# EAGLE design baseboard_v3 (EAGLE 8.1.0)
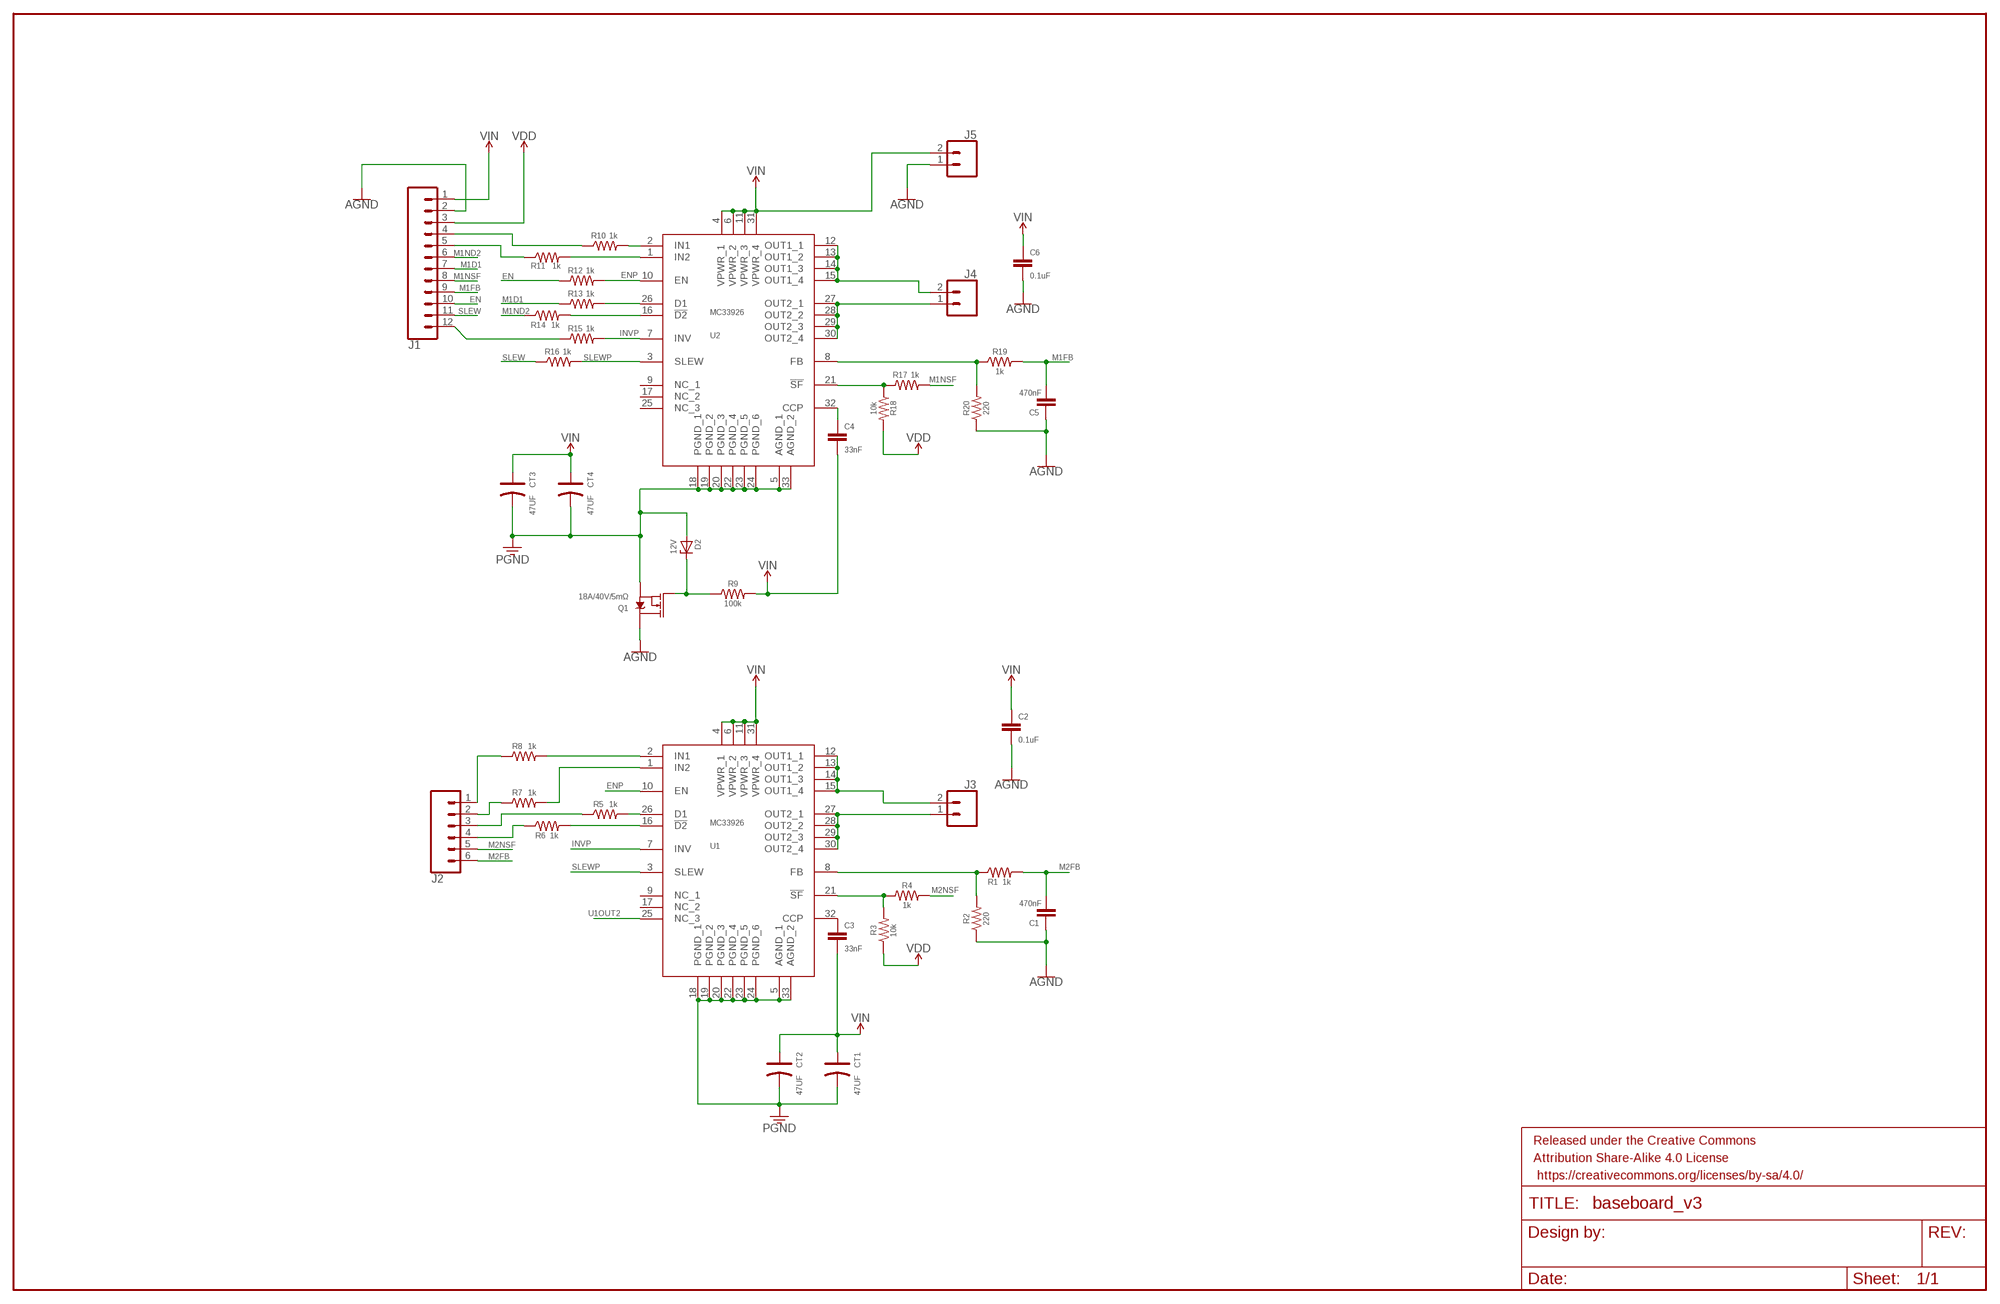
[diagram p0: schematic, sheet 1]

## Parts
C1  470nF  470NF-0402-16V-10%  [0402]
C2  0.1uF  0.1UF-0603-25V-(+80/-20%)  [0603]
C3  33nF  33NF-0603-50V-10%  [0603]
C4  33nF  33NF-0603-50V-10%  [0603]
C5  470nF  470NF-0402-16V-10%  [0402]
C6  0.1uF  0.1UF-0603-25V-(+80/-20%)  [0603]
CT1  47UF  ALUMINUM-SMD-47UF-25V(D6.3-H5.3MM)  [ELECTRO-SMD-C-6MM]
CT2  47UF  ALUMINUM-SMD-47UF-25V(D6.3-H5.3MM)  [ELECTRO-SMD-C-6MM]
CT3  47UF  ALUMINUM-SMD-47UF-25V(D6.3-H5.3MM)  [ELECTRO-SMD-C-6MM]
CT4  47UF  ALUMINUM-SMD-47UF-25V(D6.3-H5.3MM)  [ELECTRO-SMD-C-6MM]
D2  12V  ZENER-DIODESOD80C  [SOD80C]
FRAME1  FRAME-LEDGER  [CREATIVE_COMMONS]
J1  CONN_12NO_SILK  [1X12_NO_SILK]
J2  CONN_06NO_SILK_FEMALE_PTH  [1X06_NO_SILK]
J3  CONN_023.5MM-NO_SILK  [SCREWTERMINAL-3.5MM-2-NS]
J4  CONN_023.5MM-NO_SILK  [SCREWTERMINAL-3.5MM-2-NS]
J5  CONN_023.5MM-NO_SILK  [SCREWTERMINAL-3.5MM-2-NS]
Q1  18A/40V/5mΩ  MOSFET-NCH-FDS6630A  [SO08]
R1  1k  1KOHM-0603-1/10W-1%  [0603]
R2  220  220OHM-0603-1/10W-1%  [0603]
R3  10k  10KOHM-0603-1/10W-1%  [0603]
R4  1k  1KOHM-0603-1/10W-1%  [0603]
R5  1k  1KOHM-0603-1/10W-1%  [0603]
R6  1k  1KOHM-0603-1/10W-1%  [0603]
R7  1k  1KOHM-0603-1/10W-1%  [0603]
R8  1k  1KOHM-0603-1/10W-1%  [0603]
R9  100k  100KOHM-0603-1/10W-1%  [0603]
R10  1k  1KOHM-0603-1/10W-1%  [0603]
R11  1k  1KOHM-0603-1/10W-1%  [0603]
R12  1k  1KOHM-0603-1/10W-1%  [0603]
R13  1k  1KOHM-0603-1/10W-1%  [0603]
R14  1k  1KOHM-0603-1/10W-1%  [0603]
R15  1k  1KOHM-0603-1/10W-1%  [0603]
R16  1k  1KOHM-0603-1/10W-1%  [0603]
R17  1k  1KOHM-0603-1/10W-1%  [0603]
R18  10k  10KOHM-0603-1/10W-1%  [0603]
R19  1k  1KOHM-0603-1/10W-1%  [0603]
R20  220  220OHM-0603-1/10W-1%  [0603]
U1  MC33926  [PQFN32_0P8_8X8_SLUG]
U2  MC33926  [PQFN32_0P8_8X8_SLUG]

## Nets
AGND: C1.1 C2.2 C5.1 C6.2 J1.2 J5.1 Q1.5(D) Q1.6(D) Q1.7(D) Q1.8(D) R2.1 R20.1
EN: J1.10 R12.1
ENP: R12.2 U1.10(EN) U2.10(EN)
INV: J1.12 R15.1
INVP: R15.2 U1.7(INV) U2.7(INV)
M1D1: J1.7 R13.1
M1FB: C5.2 J1.9 R19.2
M1IN1: J1.4 R10.1
M1IN2: J1.5 R11.1
M1ND2: J1.6 R14.1
M1NSF: J1.8 R17.2
M2D1: J2.3 R5.1
M2FB: C1.2 J2.6 R1.2
M2IN1: J2.1(>NAME) R8.1
M2IN2: J2.2 R7.1
M2ND2: J2.4 R6.1
M2NSF: J2.5 R4.2
PGND: CT1.- CT2.- CT3.- CT4.- D2.A Q1.1(S) Q1.2(S) Q1.3(S) U1.5(AGND_1) U1.18(PGND_1) U1.19(PGND_2) U1.20(PGND_3) U1.22(PGND_4) U1.23(PGND_5) U1.24(PGND_6) U1.33(AGND_2) U2.5(AGND_1) U2.18(PGND_1) U2.19(PGND_2) U2.20(PGND_3) U2.22(PGND_4) U2.23(PGND_5) U2.24(PGND_6) U2.33(AGND_2)
SLEW: J1.11 R16.1
SLEWP: R16.2 U1.3(SLEW) U2.3(SLEW)
U1CCP: C3.1 U1.32(CCP)
U1D1: R5.2 U1.26(D1)
U1FB: R1.1 R2.2 U1.8(FB)
U1IN1: R8.2 U1.2(IN1)
U1IN2: R7.2 U1.1(IN2)
U1ND2: R6.2 U1.16(!D2)
U1NSF: R3.2 R4.1 U1.21(!SF)
U1OUT1: J3.2 U1.12(OUT1_1) U1.13(OUT1_2) U1.14(OUT1_3) U1.15(OUT1_4)
U1OUT2: J3.1 U1.25(NC_3) U1.27(OUT2_1) U1.28(OUT2_2) U1.29(OUT2_3) U1.30(OUT2_4)
U2CCP: C4.1 U2.32(CCP)
U2D1: R13.2 U2.26(D1)
U2FB: R19.1 R20.2 U2.8(FB)
U2IN1: R10.2 U2.2(IN1)
U2IN2: R11.2 U2.1(IN2)
U2ND2: R14.2 U2.16(!D2)
U2NSF: R17.1 R18.1 U2.21(!SF)
U2OUT1: J4.2 U2.12(OUT1_1) U2.13(OUT1_2) U2.14(OUT1_3) U2.15(OUT1_4)
U2OUT2: J4.1 U2.27(OUT2_1) U2.28(OUT2_2) U2.29(OUT2_3) U2.30(OUT2_4)
VCC: J1.3 R3.1 R18.2 ; supply symbol labelled VDD
VGATE: D2.C Q1.4(G) R9.1
VIN: C2.1 C3.2 C4.2 C6.1 CT1.+ CT2.+ CT3.+ CT4.+ J1.1 J5.2 R9.2 U1.4(VPWR_1) U1.6(VPWR_2) U1.11(VPWR_3) U1.31(VPWR_4) U2.4(VPWR_1) U2.6(VPWR_2) U2.11(VPWR_3) U2.31(VPWR_4)
Unconnected: U1.9(NC_1) U1.17(NC_2) U2.9(NC_1) U2.17(NC_2) U2.25(NC_3)

## Library data of the parts
C1 C5 = SparkFun-Capacitors:470NF: 0.47uF/470nF ceramic capacitors A capacitor is a passive two-terminal electrical component used to store electrical energy temporarily in an electric field.; PROD_ID: CAP-09041
C2 C6 = SparkFun-Capacitors:0.1UF: 0.1µF ceramic capacitors A capacitor is a passive two-terminal electrical component used to store electrical energy temporarily in an electric field.; PROD_ID: CAP-00810
C3 C4 = SparkFun-Capacitors:33NF: 33nF ceramic capacitors A capacitor is a passive two-terminal electrical component used to store electrical energy temporarily in an electric field.; PROD_ID: CAP-07887
CT1-CT4 = Seeed-OPL-Capacitor:ALUMINUM-SMD-47UF-25V(D6.3-H5.3MM): 302030059; MPN: CS1E470M-CRE54
D2 = diode:ZENER-DIODE: Z-Diode
FRAME1 = SparkFun-Aesthetics:FRAME-LEDGER: Schematic Frame - Ledger Standard 11x14 US Ledger frame
J1 = SparkFun-Connectors:CONN_12: Multi connection point. Often used as Generic Header-pin footprint for 0.1 inch spaced/style header connections On any of the 0.1 inch spaced packages, you can populate with these: Break Away Headers - Straight <https://www.sparkfun.com/products/116> (PRT-00116) Break Away Male Headers - Right Angle <https://www.sparkfun.com/products/553> (PRT-00553) Female Headers <https://www.sparkfun.com/products/115> (PRT-00115) Break Away Headers - Machine Pin <https://www.sparkfun.com/products/117> (PRT-00117) Break Away Female Headers - Swiss Machine Pin <https://www.sparkfun.com/products/743> (PRT-00743) For SCREWTERMINALS and SPRING TERMINALS visit here: Screw Terimnals on SparkFun.com <https://www.sparkfun.com/search/results?term=Screw+Terminals> (5mm/3.5mm/2.54mm spacing) This device is also useful as a general connection point to wire up your design to another part of your project. Our various solder wires solder well into these plated through hole pads. Hook-Up Wire - Assortment (Stranded, 22 AWG) <https://www.sparkfun.com/products/11375> (PRT-11375) Hook-Up Wire - Assortment (Solid Core, 22 AWG) <https://www.sparkfun.com/products/11367> (PRT-11367) View the entire wire category on our website here <https://www.sparkfun.com/categories/141> Special notes: Molex polarized connector foot print use with SKU : PRT-08231 with associated crimp pins and housings. 1MM SMD Version SKU: PRT-10208 NOTES ON THE VARIANTS LOCK and LOCK_LONGPADS... This footprint was designed to help hold the alignment of a through-hole component (i.e. 6-pin header) while soldering it into place. You may notice that each hole has been shifted either up or down by 0.005 of an inch from it's more standard position (which is a perfectly straight line). This slight alteration caused the pins (the squares in the middle) to touch the edges of the holes. Because they are alternating, it causes a "brace" to hold the component in place. 0.005 has proven to be the perfect amount of "off-center" position when using our standard breakaway headers. Although looks a little odd when you look at the bare footprint, once you have a header in there, the alteration is very hard to notice. Also,if you push a header all the way into place, it is covered up entirely on the bottom side.
J2 = SparkFun-Connectors:CONN_06: Multi connection point. Often used as Generic Header-pin footprint for 0.1 inch spaced/style header connections On any of the 0.1 inch spaced packages, you can populate with these: Break Away Headers - Straight <https://www.sparkfun.com/products/116> (PRT-00116) Break Away Male Headers - Right Angle <https://www.sparkfun.com/products/553> (PRT-00553) Female Headers <https://www.sparkfun.com/products/115> (PRT-00115) Break Away Headers - Machine Pin <https://www.sparkfun.com/products/117> (PRT-00117) Break Away Female Headers - Swiss Machine Pin <https://www.sparkfun.com/products/743> (PRT-00743) Arduino Stackable Header - 6 Pin <https://www.sparkfun.com/products/9280> (PRT-09280) For SCREWTERMINALS and SPRING TERMINALS visit here: Screw Terimnals on SparkFun.com <https://www.sparkfun.com/search/results?term=Screw+Terminals> (5mm/3.5mm/2.54mm spacing) This device is also useful as a general connection point to wire up your design to another part of your project. Our various solder wires solder well into these plated through hole pads. Hook-Up Wire - Assortment (Stranded, 22 AWG) <https://www.sparkfun.com/products/11375> (PRT-11375) Hook-Up Wire - Assortment (Solid Core, 22 AWG) <https://www.sparkfun.com/products/11367> (PRT-11367) View the entire wire category on our website here <https://www.sparkfun.com/categories/141>; PROD_ID: CONN-08437
J3-J5 = SparkFun-Connectors:CONN_02: Multi connection point. Often used as Generic Header-pin footprint for 0.1 inch spaced/style header connections On any of the 0.1 inch spaced packages, you can populate with these: Break Away Headers - Straight <https://www.sparkfun.com/products/116> (PRT-00116) Break Away Male Headers - Right Angle <https://www.sparkfun.com/products/553> (PRT-00553) Female Headers <https://www.sparkfun.com/products/115> (PRT-00115) Break Away Headers - Machine Pin <https://www.sparkfun.com/products/117> (PRT-00117) Break Away Female Headers - Swiss Machine Pin <https://www.sparkfun.com/products/743> (PRT-00743) For SCREWTERMINALS and SPRING TERMINALS visit here: Screw Terimnals on SparkFun.com <https://www.sparkfun.com/search/results?term=Screw+Terminals> (5mm/3.5mm/2.54mm spacing) This device is also useful as a general connection point to wire up your design to another part of your project. Our various solder wires solder well into these plated through hole pads. Hook-Up Wire - Assortment (Stranded, 22 AWG) <https://www.sparkfun.com/products/11375> (PRT-11375) Hook-Up Wire - Assortment (Solid Core, 22 AWG) <https://www.sparkfun.com/products/11367> (PRT-11367) View the entire wire category on our website here <https://www.sparkfun.com/categories/141> Special notes: Molex polarized connector foot print use with: PRT-08233 with associated crimp pins and housings. 2.54_SCREWTERM for use with PRT-10571. 3.5mm Screw Terminal footprints for PRT-08084 5mm Screw Terminal footprints for use with PRT-08432; PROD_ID: CONN-08399
Q1 = SparkFun-DiscreteSemi:MOSFET-NCH: N-channel MOSFETs Voltage controlled devices that allow control of high current outputs. SparkFun Products: SparkFun OpenScale <https://www.sparkfun.com/products/13261> SparkFun Digital Sandbox <https://www.sparkfun.com/products/12651> SparkFun Monster Moto Shield <https://www.sparkfun.com/products/10182> SparkFun MOSFET Power Controller <https://www.sparkfun.com/products/11214>; PROD_ID: TRANS-08089; VALUE: 6.5A/30V/38mΩ
R1 R4-R8 R10-R17 R19 = SparkFun-Resistors:1KOHM: 1kΩ resistor A resistor is a passive two-terminal electrical component that implements electrical resistance as a circuit element. Resistors act to reduce current flow, and, at the same time, act to lower voltage levels within circuits. - Wikipedia; PROD_ID: RES-07856
R2 R20 = SparkFun-Resistors:220OHM: 220Ω resistor A resistor is a passive two-terminal electrical component that implements electrical resistance as a circuit element. Resistors act to reduce current flow, and, at the same time, act to lower voltage levels within circuits. - Wikipedia; PROD_ID: RES-07861
R3 R18 = SparkFun-Resistors:10KOHM: 10kΩ resistor A resistor is a passive two-terminal electrical component that implements electrical resistance as a circuit element. Resistors act to reduce current flow, and, at the same time, act to lower voltage levels within circuits. - Wikipedia; PROD_ID: RES-00824
R9 = SparkFun-Resistors:100KOHM: 100kΩ resistor A resistor is a passive two-terminal electrical component that implements electrical resistance as a circuit element. Resistors act to reduce current flow, and, at the same time, act to lower voltage levels within circuits. - Wikipedia; PROD_ID: RES-07828
U1 U2 = Freescale_Element_Modified:MC33926

## Board
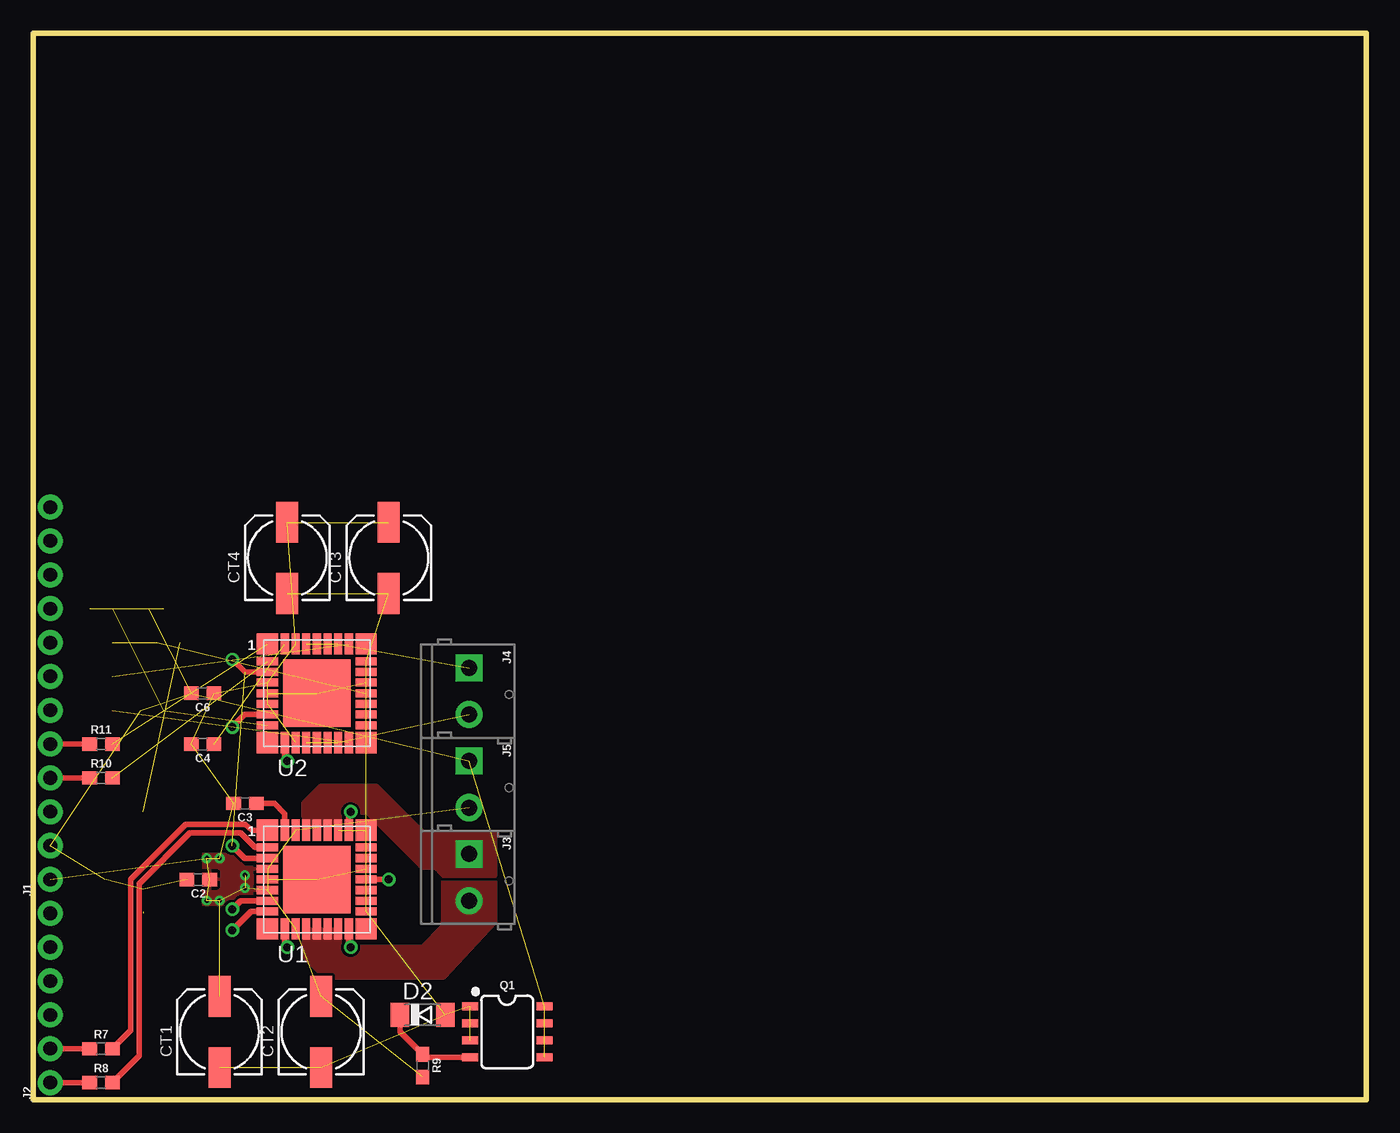
[diagram p1: board, top side]
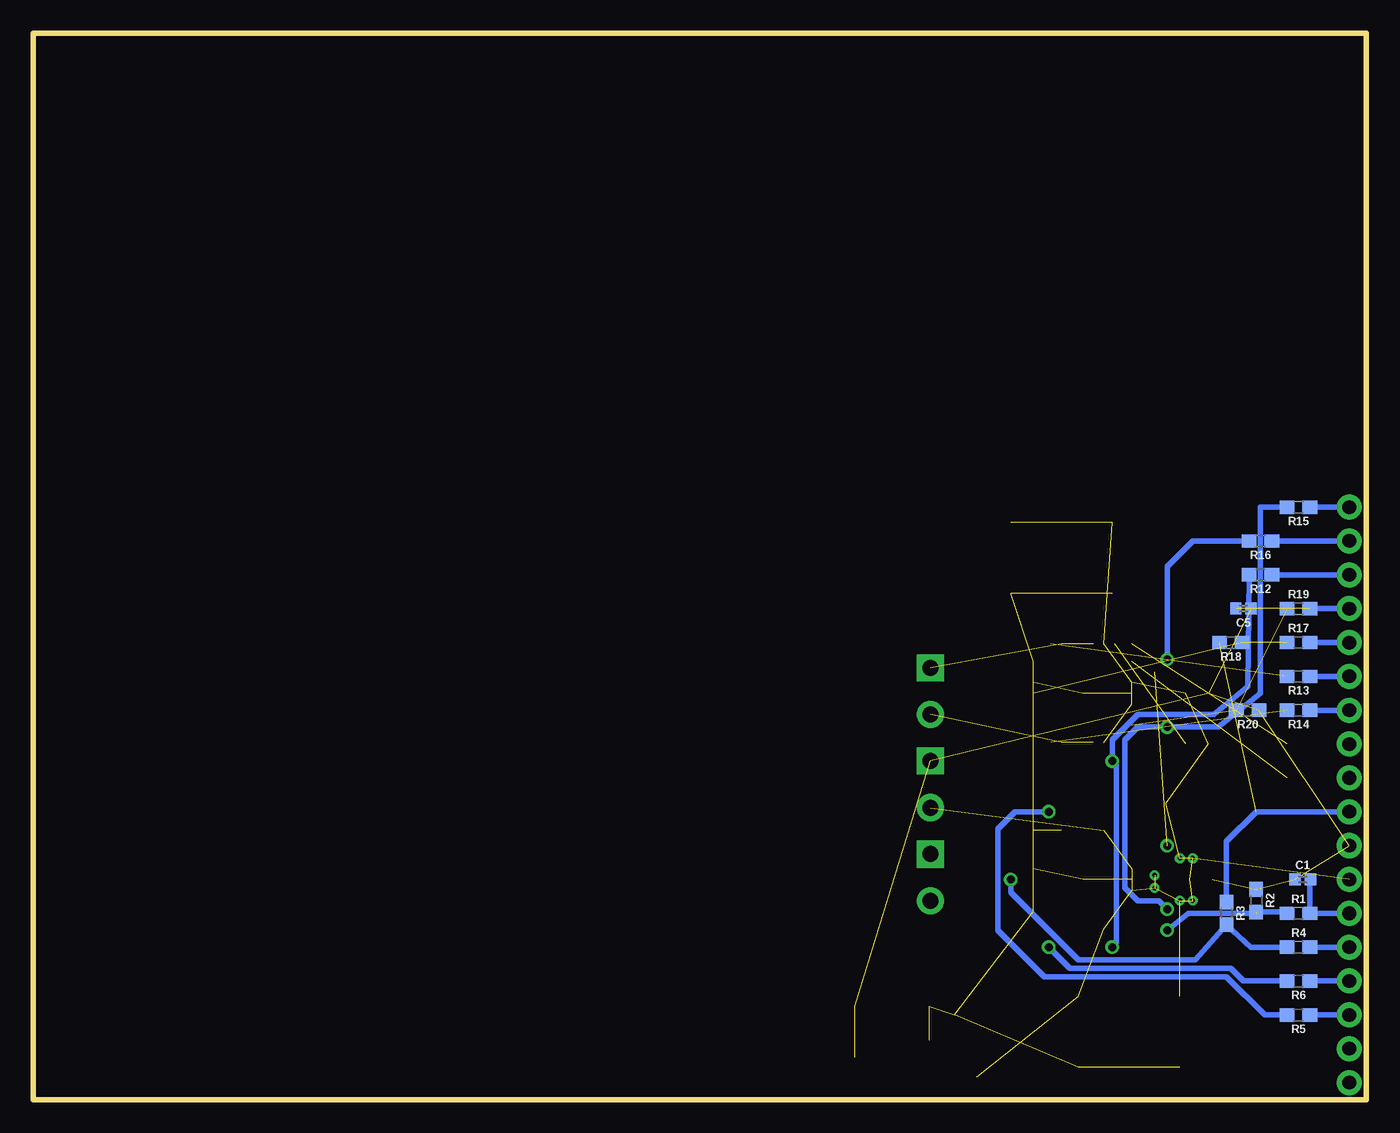
[diagram p2: board, bottom side, seen from below]

Size 100 x 80 mm. Coordinates in mm from the lower left corner, seen from the top.
Outline: 0,80 0,0 100,0 100,80 0,80
Copper layers (1*16): Top 0.035mm / dielectric 1.5mm / Bottom 0.035mm
Design rules "default": minimum track width 10mil, minimum drill 24mil, track to track 8mil, track to pad 8mil, pad to pad 8mil, via to via 8mil, smd to smd 8mil, copper to edge 40mil, drill to drill 8mil, minimum pad ring 10mil, minimum via ring 8mil, stop-mask expansion 4mil, vias tented up to drill 0mil, thermal gap 10mil

### Footprints (pad centres in the part's own frame; a part is rotated, then mirrored left to right if it is on the bottom)
0402 = smd 0.85 x 0.9: 1 -0.58,0; 2 0.58,0
0603 = smd 1.1 x 1: 1 -0.85,0; 2 0.85,0
ELECTRO-SMD-C-6MM = smd 3.048 x 1.651: + 2.667,0; - -2.667,0
SOD80C = smd 1.4 x 1.8: A 1.7,0; C -1.7,0
1X12_NO_SILK = drill 1.016 pad 1.88: 1 0,0; 2 2.54,0; 3 5.08,0; 4 7.62,0; 5 10.16,0; 6 12.7,0; 7 15.24,0; 8 17.78,0; 9 20.32,0; 10 22.86,0; 11 25.4,0; 12 27.94,0
1X06_NO_SILK = drill 1.016 pad 1.88: 1 0,0; 2 2.54,0; 3 5.08,0; 4 7.62,0; 5 10.16,0; 6 12.7,0
SCREWTERMINAL-3.5MM-2-NS = drill 1.2 pad 2.032 square: 1 0,0 | drill 1.2 pad 2.032: 2 3.5,0
SO08 = smd 0.6 x 1.2: 1 -1.905,-2.8; 2 -0.635,-2.8; 3 0.635,-2.8; 4 1.905,-2.8; 5 1.905,2.8; 6 0.635,2.8; 7 -0.635,2.8; 8 -1.905,2.8
PQFN32_0P8_8X8_SLUG = smd 1.6 x 1.6: 1 -3.7,3.7; 9 -3.7,-3.7; 17 3.7,-3.7; 25 3.7,3.7 | smd 1.6 x 0.61: 2 -3.7,2.4; 3 -3.7,1.6; 4 -3.7,0.8; 5 -3.7,0; 6 -3.7,-0.8; 7 -3.7,-1.6; 8 -3.7,-2.4; 18 3.7,-2.4; 19 3.7,-1.6; 20 3.7,-0.8; 21 3.7,0; 22 3.7,0.8; 23 3.7,1.6; 24 3.7,2.4 | smd 0.61 x 1.6: 10 -2.4,-3.7; 11 -1.6,-3.7; 12 -0.8,-3.7; 13 0,-3.7; 14 0.8,-3.7; 15 1.6,-3.7; 16 2.4,-3.7; 26 2.4,3.7; 27 1.6,3.7; 28 0.8,3.7; 29 0,3.7; 30 -0.8,3.7; 31 -1.6,3.7; 32 -2.4,3.7 | smd 5.08 x 5.08: 33 0,0

### Placement (x,y rotation side)
C1  4.76,16.51 0 bottom
C2  12.38,16.51 180 top
C3  15.88,22.23 180 top
C4  12.7,26.67 180 top
C5  9.21,36.83 180 bottom
C6  12.7,30.48 180 top
CT1  13.97,5.08 90 top
CT2  21.59,5.08 90 top
CT3  26.67,40.64 90 top
CT4  19.05,40.64 90 top
D2  29.21,6.35 0 top
FRAME1  17.78,-12.7 0 top  (outside the outline)
J1  1.27,16.51 90 top
J2  1.27,1.27 90 top
J3  32.7,18.41 270 top
J4  32.7,32.38 270 top
J5  32.7,25.4 270 top
Q1  35.56,5.08 270 top
R1  5.08,13.97 0 bottom
R2  8.26,14.92 270 bottom
R3  10.48,13.97 270 bottom
R4  5.08,11.43 0 bottom
R5  5.08,6.35 180 bottom
R6  5.08,8.89 180 bottom
R7  5.08,3.81 0 top
R8  5.08,1.27 0 top
R9  29.21,2.54 270 top
R10  5.08,24.13 0 top
R11  5.08,26.67 0 top
R12  7.94,39.37 180 bottom
R13  5.08,31.75 180 bottom
R14  5.08,29.21 180 bottom
R15  5.08,44.45 180 bottom
R16  7.94,41.91 180 bottom
R17  5.08,34.29 0 bottom
R18  10.16,34.29 180 bottom
R19  5.08,36.83 0 bottom
R20  8.89,29.21 180 bottom
U1  21.27,16.51 0 top
U2  21.27,30.48 0 top

### Tracks (layer width: path | path; a pad name or v marks a point on that pad's centre or on a via)
AGND  (11 unrouted)
EN
  Bottom 0.406: R12.1 J1.10
ENP  (via drill 0.6)
  Top 0.406: U1.10 18.87,11.57 v19.05,11.43 | U2.10 18.87,25.86 v19.05,25.4
  Bottom 0.406: v19.05,11.43 18.73,11.75 18.73,25.08 v19.05,25.4 19.05,26.99 17.14,28.89 11.43,28.89 8.89,31.01 R12.2
INV
  Bottom 0.406: R15.1 J1.12
INVP  (via drill 0.6)
  Top 0.406: U1.7 15.54,14.91 v14.92,14.29 | U2.7 15.86,28.88 v14.92,27.94
  Bottom 0.406: R15.2 7.94,44.45 7.94,30.48 11.11,27.94 v14.92,27.94 17.14,27.94 18.1,26.99 18.1,15.88 17.14,14.92 15.56,14.92 v14.92,14.29
M1D1
  Bottom 0.406: J1.7 R13.1
M1FB  (1 unrouted)
  Bottom 0.406: J1.9 R19.2
M1IN1
  Top 0.406: J1.4 R10.1
M1IN2
  Top 0.406: J1.5 R11.1
M1ND2
  Bottom 0.406: J1.6 R14.1
M1NSF
  Bottom 0.406: J1.8 R17.2
M2D1
  Bottom 0.406: J2.3 R5.1
M2FB
  Bottom 0.406: J2.6 R1.2 4.23,16.46 C1.2
M2IN1
  Top 0.406: J2.1 R8.1
M2IN2
  Top 0.406: J2.2 R7.1
M2ND2
  Bottom 0.406: J2.4 R6.1
M2NSF
  Bottom 0.406: J2.5 R4.2
N$1  (via drill 0.6)
  other vias: 14.92,19.05
PGND  (23 unrouted)
SLEW
  Bottom 0.406: J1.11 R16.1
SLEWP  (via drill 0.6)  (1 unrouted)
  Top 0.406: U1.3 15.86,18.11 14.92,19.05 | U2.3 15.89,32.08 15.88,32.07 v14.92,33.02
  Bottom 0.406: R16.2 13.02,41.91 14.92,40.01 v14.92,33.02
U1CCP
  Top 0.406: U1.32 18.87,21.45 18.1,22.23 C3.1
U1D1  (via drill 0.6)
  Top 0.406: U1.26 23.67,21.45 v23.81,21.59
  Bottom 0.406: R5.2 7.62,6.35 10.48,9.21 24.13,9.21 27.62,12.7 27.62,20.32 26.35,21.59 v23.81,21.59
U1FB  (via drill 0.6)  (1 unrouted)
  Top 0.406: U1.8 16.33,14.11 v14.92,12.7
  Bottom 0.406: 8.26,13.97 13.34,13.97 v14.92,12.7 | R2.2 6.03,14.07 R1.1
U1IN1
  Top 0.406: U1.2 16.65,18.91 15.56,20 11.75,20 7.94,16.19 7.94,3.28 R8.2
U1IN2
  Top 0.406: 17.46,20.32 U1.1 16.4,20.21 15.88,20.64 11.43,20.64 7.3,16.51 7.3,5.18 R7.2
U1ND2  (via drill 0.6)
  Top 0.406: U1.16 23.67,11.57 v23.81,11.43
  Bottom 0.406: R6.2 9.21,8.89 10.16,9.84 22.23,9.84 v23.81,11.43
U1NSF  (via drill 0.6)
  Top 0.406: U1.21 v26.67,16.51
  Bottom 0.406: R4.1 8.68,11.43 R3.2 12.8,10.48 21.59,10.48 26.67,15.56 v26.67,16.51
U1OUT1
  pour Top (isolate 0.152, rank 2, no thermals): 20.32,12.7 23.18,12.7 23.18,11.43 29.21,11.43 30.8,13.02 30.8,16.51 34.61,16.51 34.61,13.34 30.8,9.21 21.91,9.21 20.32,10.79
U1OUT2  (1 unrouted)
  pour Top (isolate 0.152, no thermals): 20.32,20.64 22.86,20.64 23.18,21.59 25.08,21.59 29.21,17.46 30.16,17.46 30.8,16.83 34.61,16.83 34.61,20 29.21,20 25.72,23.5 21.59,23.5 20.32,22.23
U2CCP  (1 unrouted)
U2D1  (1 unrouted)
U2FB  (2 unrouted)
U2IN1  (1 unrouted)
U2IN2  (1 unrouted)
U2ND2  (1 unrouted)
U2NSF  (2 unrouted)
U2OUT1  (4 unrouted)
U2OUT2  (4 unrouted)
VCC  (1 unrouted)
  Bottom 0.406: J1.3 8.26,21.59 10.48,19.37 R3.1
VGATE
  Top 0.406: D2.C 27.51,5.09 R9.1 29.43,3.17 Q1.4
VIN  (via drill 0.33)  (24 unrouted)
  other vias: 13.97,18.1 13.02,18.1 15.88,16.83 15.88,15.88 13.97,14.92 13.02,14.92
  pour Top (isolate 0.152): 12.7,18.41 12.7,14.61 15.24,14.61 15.88,15.24 17.46,15.24 17.46,17.46 15.88,17.46 14.92,18.41